# Altium schematic sheet Control.SchDoc
size B; Organization: Altium Limited; Address1: L3, 12a Rodborough Rd; Address2: Frenchs Forest; Address3: NSW; Address4: Australia 2086; DocumentNumber: 3; SheetNumber: 3; SheetTotal: 4
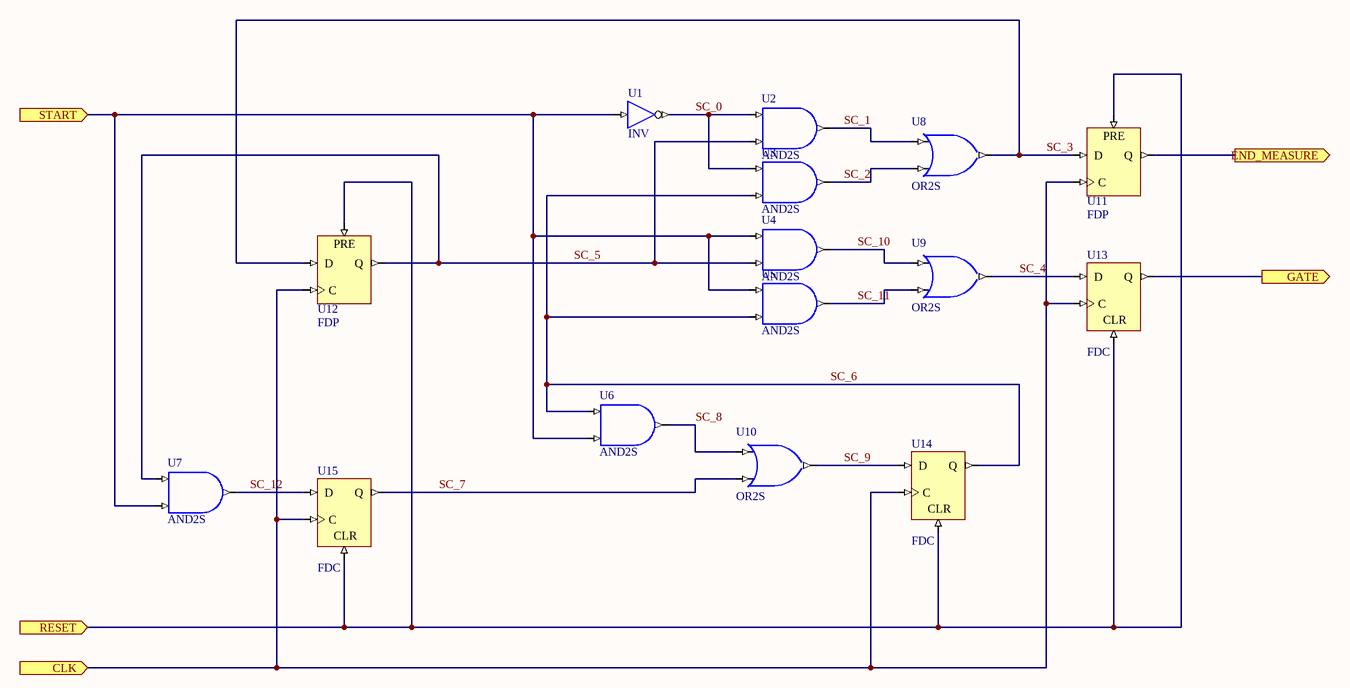
[diagram p0: Control.SchDoc]

## Parts
U1  INV
U2  AND2S
U3  AND2S
U4  AND2S
U5  AND2S
U6  AND2S
U7  AND2S
U8  OR2S
U9  OR2S
U10  OR2S
U11  FDP
U12  FDP
U13  FDC
U14  FDC
U15  FDC

## Ports
CLK (in), END_MEASURE (out), GATE (out), RESET (in), START (in)

## Nets
CLK: U11.C U12.C U13.C U14.C U15.C ; port CLK
END_MEASURE: U11.Q ; port END_MEASURE
GATE: U13.Q ; port GATE
RESET: U11.PRE U12.PRE U13.CLR U14.CLR U15.CLR ; port RESET
SC_0: U1.O U2.I0 U3.I0
SC_1: U2.O U8.I0
SC_2: U3.O U8.I1
SC_3: U8.O U11.D U12.D
SC_4: U9.O U13.D
SC_5: U2.I1 U4.I1 U7.I0 U12.Q
SC_6: U3.I1 U5.I1 U6.I0 U14.Q
SC_7: U10.I1 U15.Q
SC_8: U6.O U10.I0
SC_9: U10.O U14.D
SC_10: U4.O U9.I0
SC_11: U5.O U9.I1
SC_12: U7.O U15.D
START: U1.I U4.I0 U5.I0 U6.I1 U7.I1 ; port START

## Notes on the sheet
- Title
- Size:
- Date:
- B
- Number:
- Time:
- Revision:
- Sheet
- of
- File:

## Library data of the parts
U1 = INV: Inverter; ArchiveName: GENERIC; VHDLIB_SIM: GENERIC_LIB; Published: 28-Jan-2004; Publisher: Altium Limited; Xilinx Equivalent: INV; Core Revision: 1.00.00
U2-U7 = AND2S: 2-Input AND Gate, Single Pin Version; Xilinx Equivalent: AND2; ArchiveName: GENERIC; VHDLIB_SIM: GENERIC_LIB; Published: 28-Jan-2004; Publisher: Altium Limited; Core Revision: 1.00.00
U8-U10 = OR2S: 2-Input OR Gate, Single Pin Version; Xilinx Equivalent: OR2; ArchiveName: GENERIC; VHDLIB_SIM: GENERIC_LIB; Published: 28-Jan-2004; Publisher: Altium Limited; Core Revision: 1.00.00
U11 U12 = FDP: D-Type Flip-Flop with Asynchronous Preset; ArchiveName: GENERIC; VHDLIB_SIM: GENERIC_LIB; Published: 28-Jan-2004; Publisher: Altium Limited; Xilinx Equivalent: FDP; Core Revision: 1.00.00
U13-U15 = FDC: D-Type Flip-Flop with Asynchronous Clear; ArchiveName: GENERIC; VHDLIB_SIM: GENERIC_LIB; Published: 28-Jan-2004; Publisher: Altium Limited; Xilinx Equivalent: FDC; Core Revision: 1.00.00